# EAGLE design SparkFun_microSD_Breakout (EAGLE 7.5.0)
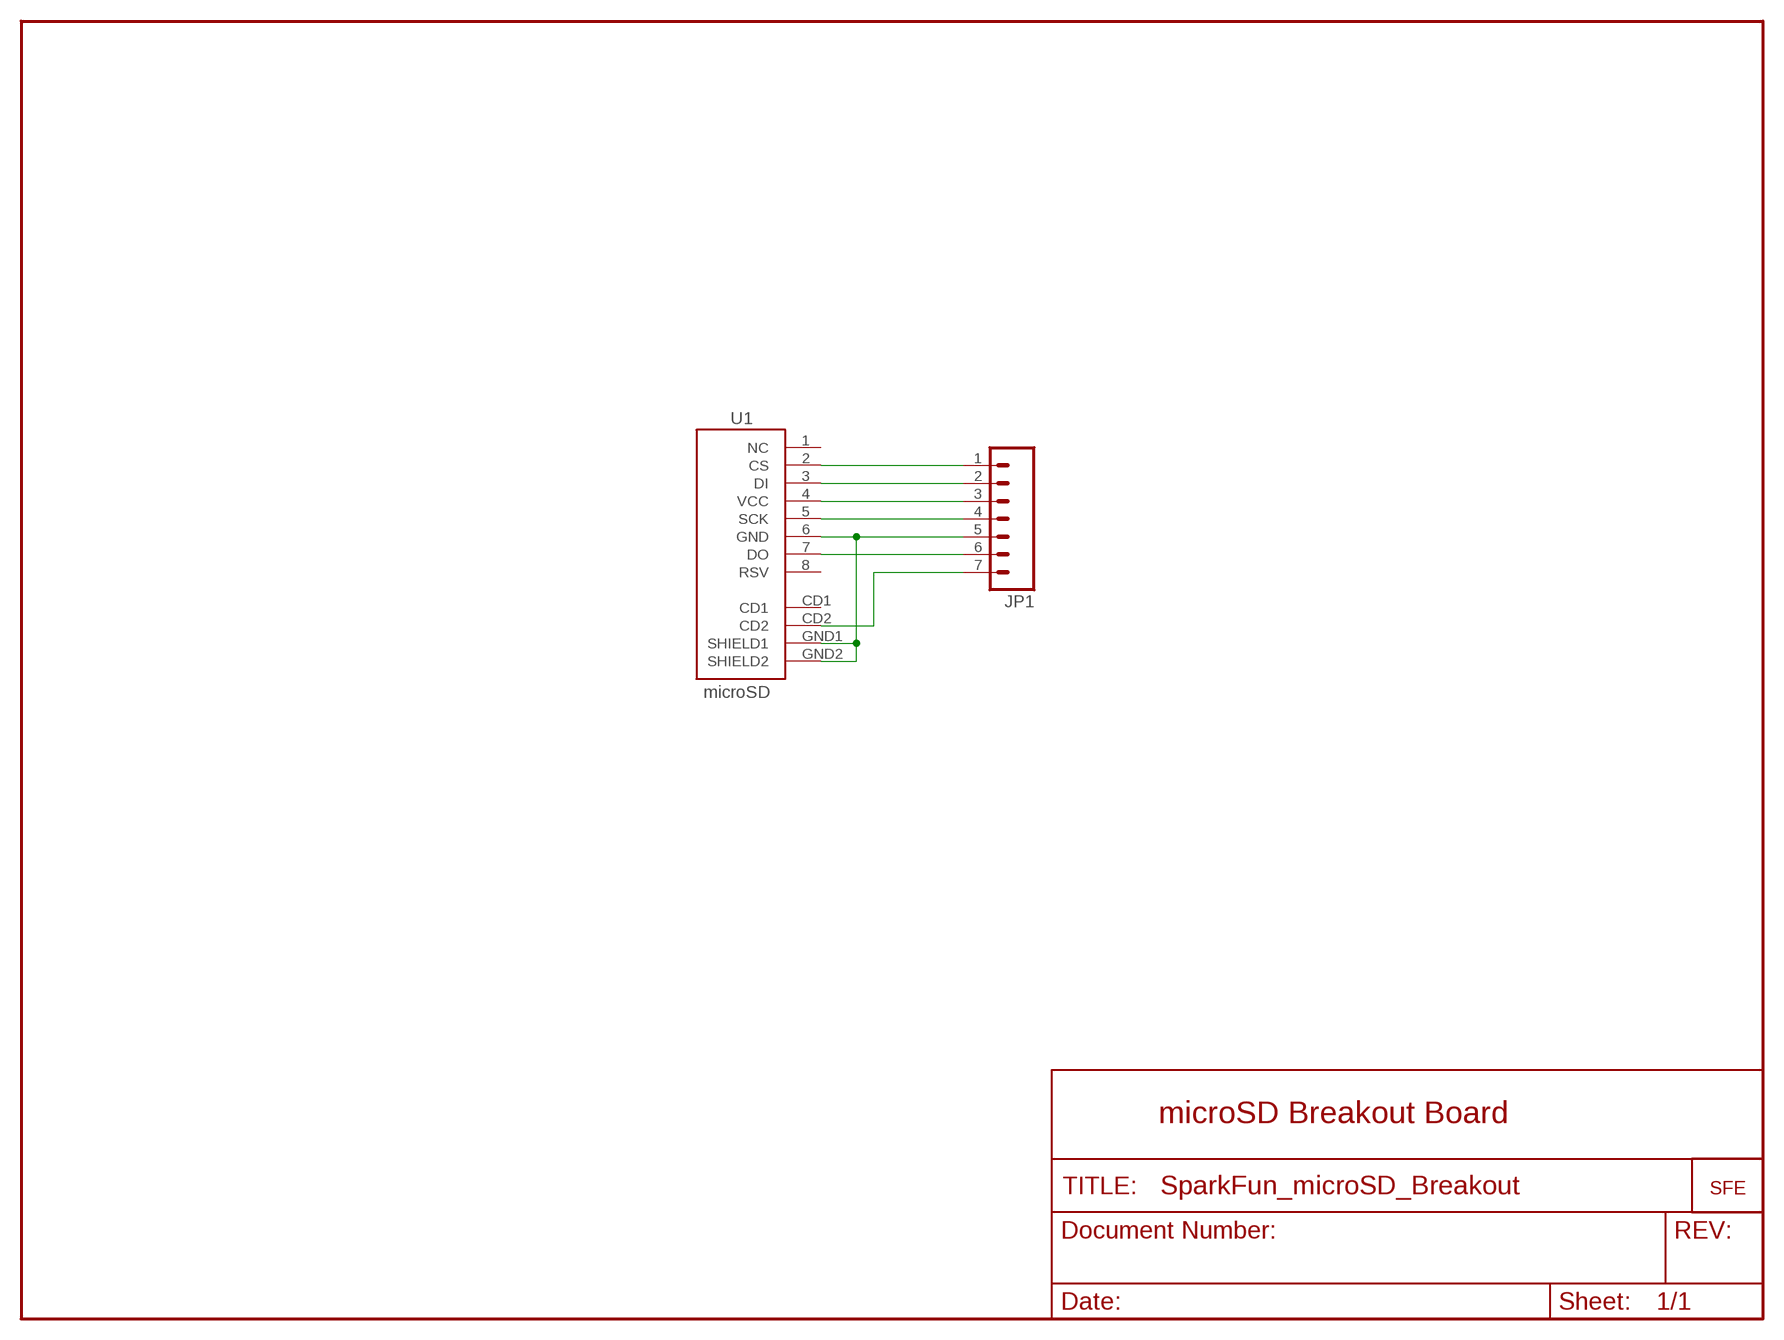
[diagram p0: schematic, sheet 1]

## Parts
JP1  M07  [1X07]
U1  microSD  USD-SOCKETSMD  [MICRO-SD-SOCKET-PP]
U$1  LOGO-SFENEW  [SFE-NEW-WEBLOGO]

## Nets
CD1: JP1.7 U1.CD2
CS: JP1.1 U1.2(CS)
DI: JP1.2 U1.3(DI)
DO: JP1.6 U1.7(DO)
GND: JP1.5 U1.6(GND) U1.GND1(SHIELD1) U1.GND2(SHIELD2)
SCK: JP1.4 U1.5(SCK)
VCC: JP1.3 U1.4(VCC)
Unconnected: U1.1(NC) U1.8(RSV) U1.CD1

## Notes on the sheet
- microSD Breakout Board

## Library data of the parts
JP1 = SparkFun:M07: Header 7 Standard 7-pin 0.1" header. Use with straight break away headers (SKU : PRT-00116), right angle break away headers (PRT-00553), swiss pins (PRT-00743), machine pins (PRT-00117), and female headers (PRT-00115). NOTES ON THE VARIANTS LOCK and LOCK_LONGPADS... This footprint was designed to help hold the alignment of a through-hole component (i.e. 7-pin header) while soldering it into place. You may notice that each hole has been shifted either up or down by 0.005 of an inch from it's more standard position (which is usually a perfectly straight line). This slight alteration caused the pins (the squares in the middle) to touch the edges of the holes. Because they are alternating, it causes a "brace" to hold the header in place. 0.005 has proven to be the perfect amount of "off-center" position when using our standard breakaway headers. Although looks a little odd when you look at the bare footprint, once you have a header in there, the alteration is very hard to notice. Also, if you push a header all the way into place, it is covered up entirely on the bottom side. This idea of altering the position of holes to aid alignment will be further integrated into the Sparkfun Library for other footprints. It can help hold any component with 3 or more connection pins.
U1 = SparkFun:USD-SOCKET: microSD Socket Push-push type uSD socket. Schematic element and footprint production proven. Spark Fun Electronics SKU : PRT-00127. tDoc lines correctly indicate media card edge positions when inserting (unlocked, locked, depressed).
U$1 = SparkFun:LOGO-SFE: Spark Fun Electronics PCB Logo This is the standard Spark Fun Electronics PCB logo.

## Board
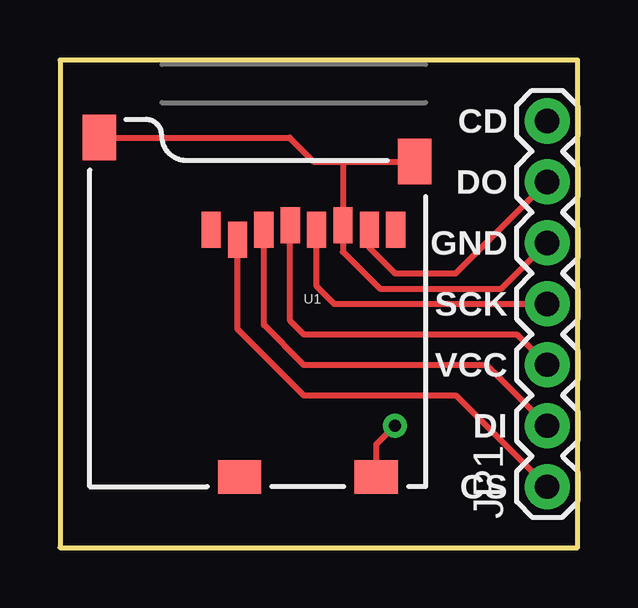
[diagram p1: board, top side]
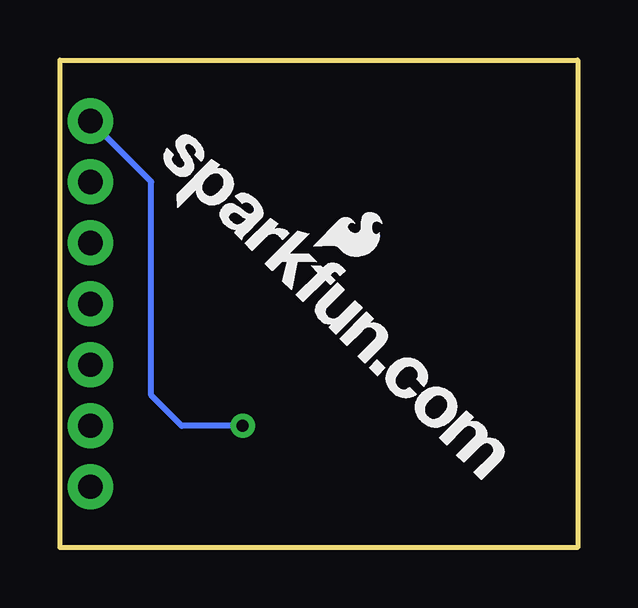
[diagram p2: board, bottom side, seen from below]

Size 21.59 x 20.32 mm. Coordinates in mm from the lower left corner, seen from the top.
Outline: 0,0 21.59,0 21.59,20.32 0,20.32 0,0
Copper layers (1*16): Top 0.035mm / dielectric 1.5mm / Bottom 0.035mm
Design rules "SparkFun": minimum track width 8mil, minimum drill 20mil, track to track 8mil, track to pad 8mil, pad to pad 8mil, via to via 8mil, smd to smd 8mil, copper to edge 10mil, drill to drill 8mil, minimum pad ring 12mil, minimum via ring 10mil, stop-mask expansion 4mil, vias tented up to drill 20mil, thermal gap 10mil

### Footprints (pad centres in the part's own frame; a part is rotated, then mirrored left to right if it is on the bottom)
1X07 = drill 1.016 pad 1.88: 1 0,0; 2 2.54,0; 3 5.08,0; 4 7.62,0; 5 10.16,0; 6 12.7,0; 7 15.24,0
MICRO-SD-SOCKET-PP = smd 0.8 x 1.5: 1 -8.94,10.7; 2 -7.84,10.3; 3 -6.74,10.7; 4 -5.64,10.9; 5 -4.54,10.7; 6 -3.44,10.9; 7 -2.34,10.7; 8 -1.24,10.7 | smd 1.8 x 1.4: CD1 -7.75,0.4; CD2 -2.05,0.4 | smd 1.4 x 1.9: GND1 -13.6,14.55; GND2 -0.45,13.55

### Placement (x,y rotation side)
JP1  20.32,2.54 90 top
U1  15.24,2.54 0 top
U$1  18.16,15.62 315 bottom

### Tracks (layer width: path | path; a pad name or v marks a point on that pad's centre or on a via)
CD1  (via drill 0.51)
  Top 0.254: U1.CD2 13.19,4.3 v13.97,5.08
  Bottom 0.254: v13.97,5.08 16.51,5.08 17.78,6.35 17.78,15.24 JP1.7
CS
  Top 0.254: U1.2 7.4,9.11 10.16,6.35 16.51,6.35 JP1.1
DI
  Top 0.254: U1.3 8.5,9.28 10.16,7.62 17.78,7.62 JP1.2
DO
  Top 0.254: U1.7 12.9,12.5 13.97,11.43 16.51,11.43 JP1.6
GND
  Top 0.254: JP1.5 18.41,10.79 13.34,10.79 11.8,12.33 U1.6 11.8,16.08 11.81,16.09 | U1.GND1 9.58,17.09 10.58,16.09 11.81,16.09 | 11.81,16.09 U1.GND2
SCK
  Top 0.254: U1.5 10.7,10.89 11.43,10.16 JP1.4
VCC
  Top 0.254: U1.4 9.6,9.45 10.16,8.89 19.05,8.89 JP1.3

### Text on the board
tPlace: CD | DO | GND | SCK | VCC | DI | CS